# EAGLE design Triple_Axis_Accelerometer_-_Gyro_Breakout_-_MPU-6050 (EAGLE 6.4)
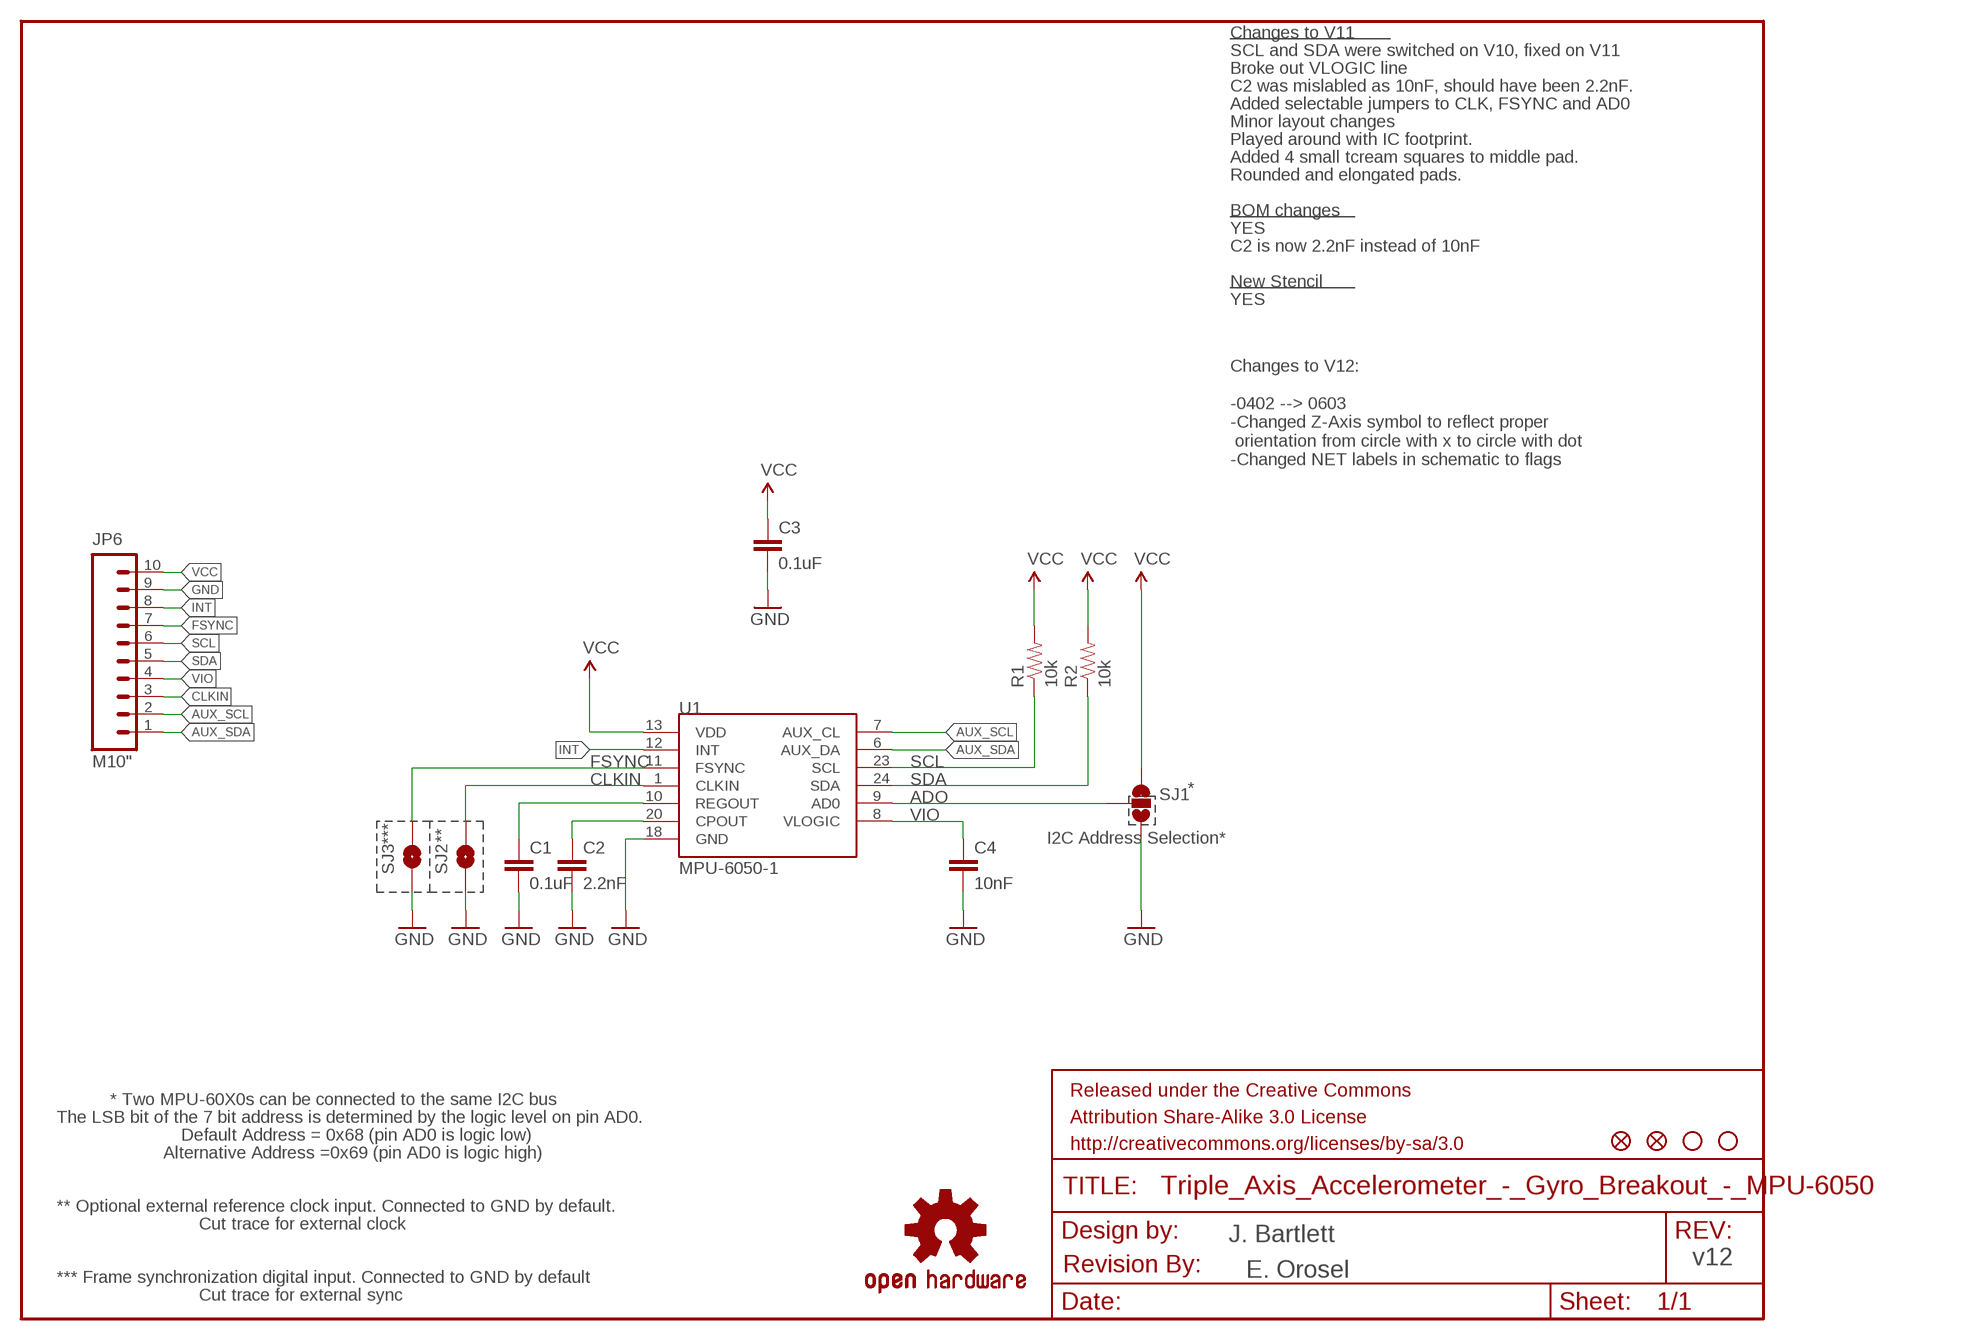
[diagram p0: schematic, sheet 1]

## Parts
C1  0.1uF  CAP0603-CAP  [0603-CAP]
C2  2.2nF  CAP0603-CAP  [0603-CAP]
C3  0.1uF  CAP0603-CAP  [0603-CAP]
C4  10nF  CAP0603-CAP  [0603-CAP]
FRAME1  FRAME-LETTER  [CREATIVE_COMMONS]
JP2  FIDUCIALUFIDUCIAL  [MICRO-FIDUCIAL]
JP3  STAND-OFFTIGHT  [STAND-OFF-TIGHT]
JP4  STAND-OFFTIGHT  [STAND-OFF-TIGHT]
JP5  FIDUCIALUFIDUCIAL  [MICRO-FIDUCIAL]
JP6  M10"  [1X10]
R1  10k  RESISTOR0603-RES  [0603-RES]
R2  10k  RESISTOR0603-RES  [0603-RES]
SJ1  SOLDERJUMPER_2WAYPASTE2&3  [SJ_3_PASTE2&3]
SJ2  SOLDERJUMPERTRACE  [SJ_2S-TRACE]
SJ3  SOLDERJUMPERTRACE  [SJ_2S-TRACE]
U1  MPU-6050-1  [QFN-24-4MM2]
U$1  OSHW-LOGOS  [OSHW-LOGO-S]
U$5  REVISION  [REVISION]

## Nets
ADO: SJ1.2 U1.9(AD0)
AUX_SCL: JP6.2 U1.7(AUX_CL)
AUX_SDA: JP6.1 U1.6(AUX_DA)
CLKIN: JP6.3 SJ2.2 U1.1(CLKIN)
FSYNC: JP6.7 SJ3.2 U1.11(FSYNC)
GND: C1.2 C2.2 C3.2 C4.2 JP6.9 SJ1.3 SJ2.1 SJ3.1 U1.18(GND)
INT: JP6.8 U1.12(INT)
N$3: C2.1 U1.20(CPOUT)
N$5: C1.1 U1.10(REGOUT)
SCL: JP6.6 R1.1 U1.23(SCL)
SDA: JP6.5 R2.1 U1.24(SDA)
VCC: C3.1 JP6.10 R1.2 R2.2 SJ1.1 U1.13(VDD)
VIO: C4.1 JP6.4 U1.8(VLOGIC)

## Notes on the sheet
- Changes to V11
- SCL and SDA were switched on V10, fixed on V11
- Broke out VLOGIC line
- C2 was mislabled as 10nF, should have been 2.2nF.
- Added selectable jumpers to CLK, FSYNC and AD0
- Minor layout changes
- Played around with IC footprint.
- Added 4 small tcream squares to middle pad.
- Rounded and elongated pads.
- BOM changes
- YES
- C2 is now 2.2nF instead of 10nF
- New Stencil
- YES
- Changes to V12:
  
  -0402 --> 0603
  -Changed Z-Axis symbol to reflect proper
   orientation from circle with x to circle with dot
  -Changed NET labels in schematic to flags
- *
- *** | ** | I2C Address Selection*
- * Two MPU-60X0s can be connected to the same I2C bus
- The LSB bit of the 7 bit address is determined by the logic level on pin AD0.
- Default Address = 0x68 (pin AD0 is logic low)
- Alternative Address =0x69 (pin AD0 is logic high)
- ** Optional external reference clock input. Connected to GND by default.
- Cut trace for external clock
- J. Bartlett
- v12
- E. Orosel
- *** Frame synchronization digital input. Connected to GND by default
- Cut trace for external sync

## Library data of the parts
C1-C4 = SparkFun:CAP: Capacitor Standard 0603 ceramic capacitor, and 0.1" leaded capacitor.
FRAME1 = SparkFun-Aesthetics:FRAME-LETTER: Schematic Frame Standard 8.5x11 US Letter frame
JP2 JP5 = SparkFun:FIDUCIAL: Fiducial Alignment Points Various fiducial points for machine vision alignment.
JP3 JP4 = SparkFun:STAND-OFF: Stand Off This is the mechanical footprint for a #4 phillips button head screw. Use the keepout ring to avoid running the screw head into surrounding components. SKU : PRT-00447
JP6 = SparkFun:M10: Header 10 Standard 10-pin 0.1" header. Use with straight break away headers (SKU : PRT-00116), right angle break away headers (PRT-00553), swiss pins (PRT-00743), machine pins (PRT-00117), and female headers (PRT-00115).
R1 R2 = SparkFun:RESISTOR: Resistor Basic schematic elements and footprints for 0603, 1206, and PTH resistors.
SJ1 = SparkFun:SOLDERJUMPER_2WAY: Solder Jumper 2 way solder jumper
SJ2 SJ3 = SparkFun:SOLDERJUMPER: Solder Jumper Standard SMD solder jumper. Used to automate production. Two varients : Normally Open and Normally Closed are the same, but have different paste layers. NC will have a large amount of paste and should jumper during reflow.
U1 = Testing:MPU-6050
U$1 = SparkFun:OSHW-LOGO: Open Source Hardware Logo This logo indicates the piece of hardware it is found on incorporates a OSHW license and/or adheres to the definition of open source hardware found here: http://freedomdefined.org/OSHW
U$5 = SparkFun-Aesthetics:REVISION

## Net classes
0 Default: width 0.203 mm
1 vcc: width 0.254 mm
2 GND: width 0.813 mm

## Board
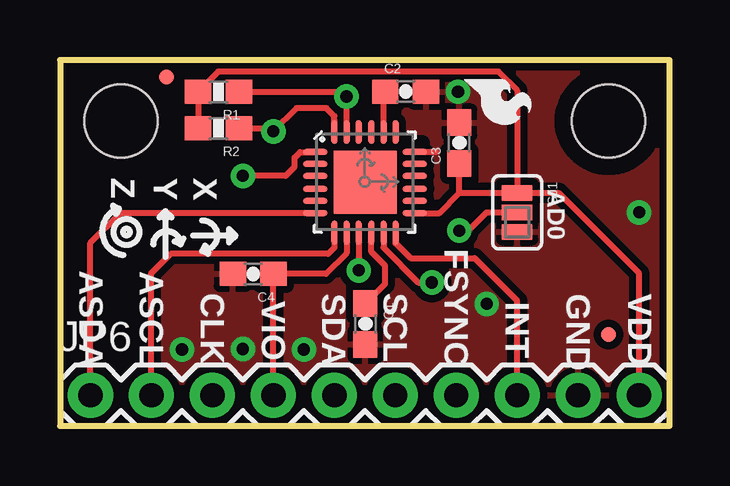
[diagram p1: board, top side]
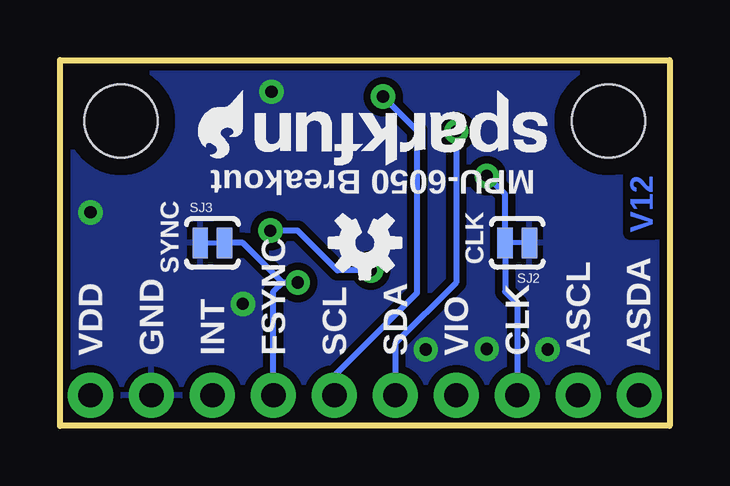
[diagram p2: board, bottom side, seen from below]

Size 25.4 x 15.24 mm. Coordinates in mm from the lower left corner, seen from the top.
Outline: 25.4,0 25.4,15.24 0,15.24 0,0 25.4,0
Copper layers (1*16): Top 0.035mm / dielectric 1.5mm / Bottom 0.035mm
Design rules "SparkFun *": minimum track width 7mil, minimum drill 15mil, track to track 8mil, track to pad 8mil, pad to pad 8mil, via to via 8mil, smd to smd 8mil, copper to edge 8mil, drill to drill 8mil, minimum pad ring 12mil, minimum via ring 10mil, stop-mask expansion 4mil, vias tented up to drill 20mil, thermal gap 10mil
tRestrict: area 14.5,11.6 to 15.1,11.8

### Footprints (pad centres in the part's own frame; a part is rotated, then mirrored left to right if it is on the bottom)
0603-CAP = smd 1.1 x 1: 1 -0.85,0; 2 0.85,0
MICRO-FIDUCIAL = smd 0.635 x 0.635: 1 0,0
STAND-OFF-TIGHT = hole 3.048: 0,0
1X10 = drill 1.016 pad 1.88: 1 0,0; 2 2.54,0; 3 5.08,0; 4 7.62,0; 5 10.16,0; 6 12.7,0; 7 15.24,0; 8 17.78,0; 9 20.32,0; 10 22.86,0
0603-RES = smd 1.1 x 1: 1 -0.85,0; 2 0.85,0
SJ_3_PASTE2&3 = smd 0.635 x 1.27: 1 -0.813,0; 2 0,0; 3 0.813,0
SJ_2S-TRACE = smd 0.635 x 1.27: 1 -0.508,0; 2 0.508,0
QFN-24-4MM2 = smd 1.016 x 0.254: 1 -2.066,1.257; 2 -2.066,0.75; 3 -2.066,0.247; 4 -2.066,-0.287; 5 -2.066,-0.792; 6 -2.066,-1.297; 13 2.086,-1.297; 14 2.086,-0.792; 15 2.086,-0.287; 16 2.086,0.247; 17 2.086,0.75; 18 2.086,1.257 | smd 0.254 x 1.016: 7 -1.267,-2.122; 8 -0.762,-2.122; 9 -0.258,-2.122; 10 0.278,-2.122; 11 0.78,-2.122; 12 1.287,-2.122; 19 1.287,2.082; 20 0.78,2.082; 21 0.278,2.082; 22 -0.258,2.082; 23 -0.762,2.082; 24 -1.267,2.082 | smd 2.616 x 2.616: P$1 0.02,-0.01

### Placement (x,y rotation side)
C1  12.73,4.24 270 top
C2  14.4,13.92 0 top
C3  16.64,11.79 90 top
C4  8.05,6.32 180 top
FRAME1  -13.44,-10.16 0 top  (outside the outline)
JP2  4.45,14.53 270 top
JP3  22.86,12.7 270 top
JP4  2.54,12.7 270 top
JP5  22.86,3.81 270 top
JP6  1.27,1.27 0 top
R1  6.6,13.92 180 top
R2  6.6,12.4 180 top
SJ1  19.05,8.89 270 top
SJ2  6.35,7.62 180 bottom
SJ3  19.05,7.62 0 bottom
U1  12.7,10.16 0 top
U$1  12.7,7.62 180 bottom
U$2  [SFE-LOGO-FLAME]  16.84,14.43 270 top
U$3  [SFE-LOGO-FLAME]  17.78,13.97 180 bottom
U$4  [SFE-NEW-WEB]  5.08,13.97 180 bottom
U$5  -1.27,-13.97 0 top  (outside the outline)

### Tracks (layer width: path | path; a pad name or v marks a point on that pad's centre or on a via)
ADO  (via drill 0.51)
  Top 0.254: v16.64,8.13 17.02,8.13 17.78,8.89 SJ1.2 | U1.9 v12.44,6.48 v12.45,6.48
  Bottom 0.254: v12.45,6.48 13.84,6.48 15.49,8.13 v16.64,8.13
AUX_SCL
  Top 0.254: U1.7 11.43,7.42 11.18,7.16 4.62,7.16 3.79,6.33 3.79,1.29 JP6.2
AUX_SDA
  Top 0.254: JP6.1 1.27,7.62 2.51,8.86 U1.6
CLKIN  (via drill 0.51)
  Top 0.254: v7.62,10.41 9.4,10.41 9.78,10.79 9.78,11.18 10.01,11.4 10.62,11.4 U1.1
  Bottom 0.254: v7.62,10.41 6.86,9.65 SJ2.2 6.86,5.59 6.35,5.08 JP6.3
FSYNC  (via drill 0.51)
  Top 0.254: U1.11 13.48,7.42 14.94,5.97 v15.49,5.97
  Bottom 0.254: JP6.7 16.51,5.59 16.13,5.97 | v15.49,5.97 16.13,5.97 | 16.13,5.97 17.78,7.62 SJ3.2
GND  (via drill 0.51)
  Top 0.254: U1.18 15.66,11.42 15.67,11.43
  other vias: 16.59,13.92 17.78,5.08 24.13,8.89 10.16,3.17 7.62,3.2 5.08,3.17
  pour Top (isolate 0.305): 25.4,15.24 0,15.24 0,0 25.4,0
  pour Bottom (isolate 0.305): 25.4,15.24 0,15.24 0,0 25.4,0
INT
  Top 0.254: JP6.8 19.05,5.21 17.27,6.99 14.61,6.99 13.99,7.6 U1.12
N$3
  Top 0.254: U1.20 13.48,13.92 C2.1
N$5
  Top 0.254: C1.1 13.54,5.91 13.54,6.68 12.98,7.24 U1.10
SCL  (via drill 0.51)
  Top 0.254: U1.23 v11.94,13.72 | v11.94,13.72 | R1.1 11.73,13.92 v11.94,13.72
  Bottom 0.254: v11.94,13.72 10.52,12.29 10.52,5.54 13.97,2.08 JP6.6
SDA  (via drill 0.51)
  Top 0.254: U1.24 11.43,12.7 | 11.43,12.72 11.43,12.7 | 11.43,12.7 11.43,12.9 11.1,13.23 9.86,13.23 v8.89,12.27 | 8.87,12.24 v8.89,12.27 | R2.1 8.76,12.39 v8.89,12.27
  Bottom 0.254: v8.89,12.27 8.89,5.97 11.43,3.43 JP6.5
VCC
  Top 0.254: SJ1.1 20.78,9.7 24.13,6.35 JP6.10 | R2.2 R1.2 6.59,14.76 18.26,14.76 19.05,13.97 SJ1.1 | 16.36,10.66 C3.1 16.64,9.7 | U1.13 15.8,8.86 16.64,9.7 | 16.64,9.7 SJ1.1
VIO
  Top 0.254: JP6.4 C4.1 | 8.93,6.35 C4.1 | 9.11,6.53 C4.1 | U1.8 11.94,7.19 11.07,6.33 C4.1

### Text on the board
Bottom: V12
tPlace: Z | Y | X | AD0 | FSYNC | ASDA | ASCL | CLK | SDA | SCL | GND | VDD | VIO | INT
bPlace: MPU-6050 Breakout | CLK | SYNC | ASDA | ASCL | CLK | VIO | SDA | SCL | FSYNC | INT | GND | VDD
tValues: Joel Bartlett | Eric Orosel